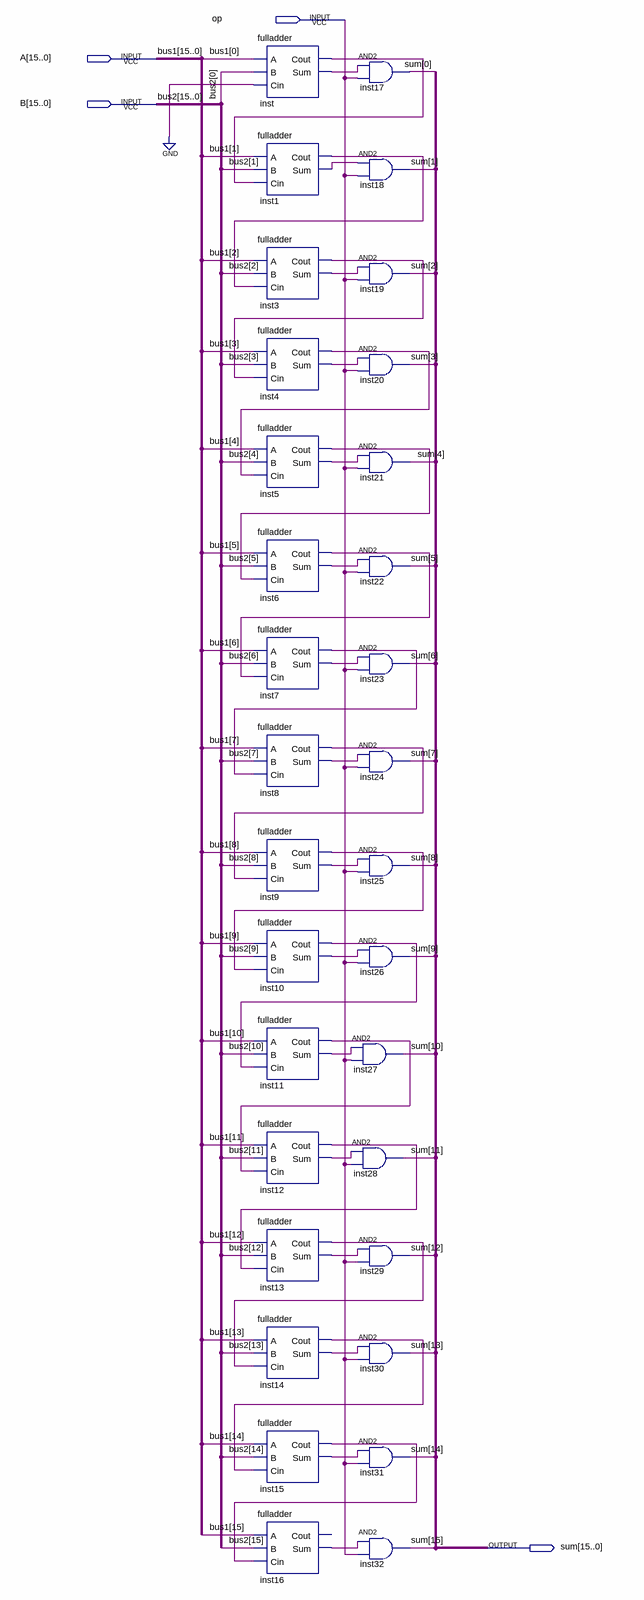
[diagram p0: schematic sheet]
// Quartus schematic adder16bit.bdf as structural Verilog: 32 symbols, 4 pins
module adder16bit (
  input  op,
  input  [15:0] A,
  input  [15:0] B,
  output [15:0] sum
);

  wire inst1_cout, inst1_sum, inst3_cout, inst3_sum, inst4_cout, inst4_sum, inst5_cout, inst5_sum,
       inst6_cout, inst6_sum, inst7_cout, inst7_sum, inst8_cout, inst8_sum, inst9_cout, inst9_sum,
       inst10_cout, inst10_sum, inst11_cout, inst11_sum, inst12_cout, inst12_sum, inst13_cout, inst13_sum,
       inst14_cout, inst14_sum, inst15_cout, inst15_sum, inst16_sum, inst_cout, inst_sum;

  fulladder inst (.A(A[0]), .B(B[0]), .Cin(1'b0), .Cout(inst_cout), .Sum(inst_sum));
  fulladder inst1 (.A(A[1]), .B(B[1]), .Cin(inst_cout), .Cout(inst1_cout), .Sum(inst1_sum));
  fulladder inst3 (.A(A[2]), .B(B[2]), .Cin(inst1_cout), .Cout(inst3_cout), .Sum(inst3_sum));
  fulladder inst4 (.A(A[3]), .B(B[3]), .Cin(inst3_cout), .Cout(inst4_cout), .Sum(inst4_sum));
  fulladder inst5 (.A(A[4]), .B(B[4]), .Cin(inst4_cout), .Cout(inst5_cout), .Sum(inst5_sum));
  fulladder inst6 (.A(A[5]), .B(B[5]), .Cin(inst5_cout), .Cout(inst6_cout), .Sum(inst6_sum));
  fulladder inst7 (.A(A[6]), .B(B[6]), .Cin(inst6_cout), .Cout(inst7_cout), .Sum(inst7_sum));
  fulladder inst8 (.A(A[7]), .B(B[7]), .Cin(inst7_cout), .Cout(inst8_cout), .Sum(inst8_sum));
  fulladder inst9 (.A(A[8]), .B(B[8]), .Cin(inst8_cout), .Cout(inst9_cout), .Sum(inst9_sum));
  fulladder inst10 (.A(A[9]), .B(B[9]), .Cin(inst9_cout), .Cout(inst10_cout), .Sum(inst10_sum));
  fulladder inst11 (.A(A[10]), .B(B[10]), .Cin(inst10_cout), .Cout(inst11_cout), .Sum(inst11_sum));
  fulladder inst12 (.A(A[11]), .B(B[11]), .Cin(inst11_cout), .Cout(inst12_cout), .Sum(inst12_sum));
  fulladder inst13 (.A(A[12]), .B(B[12]), .Cin(inst12_cout), .Cout(inst13_cout), .Sum(inst13_sum));
  fulladder inst14 (.A(A[13]), .B(B[13]), .Cin(inst13_cout), .Cout(inst14_cout), .Sum(inst14_sum));
  fulladder inst15 (.A(A[14]), .B(B[14]), .Cin(inst14_cout), .Cout(inst15_cout), .Sum(inst15_sum));
  fulladder inst16 (.A(A[15]), .B(B[15]), .Cin(inst15_cout), .Sum(inst16_sum));  // open: Cout
  and inst17 (sum[0], inst_sum, op);
  and inst18 (sum[1], inst1_sum, op);
  and inst19 (sum[2], inst3_sum, op);
  and inst20 (sum[3], inst4_sum, op);
  and inst21 (sum[4], inst5_sum, op);
  and inst22 (sum[5], inst6_sum, op);
  and inst23 (sum[6], inst7_sum, op);
  and inst24 (sum[7], inst8_sum, op);
  and inst25 (sum[8], inst9_sum, op);
  and inst26 (sum[9], inst10_sum, op);
  and inst27 (sum[10], inst11_sum, op);
  and inst28 (sum[11], inst12_sum, op);
  and inst29 (sum[12], inst13_sum, op);
  and inst30 (sum[13], inst14_sum, op);
  and inst31 (sum[14], inst15_sum, op);
  and inst32 (sum[15], inst16_sum, op);

  // Other names for the same wires on the sheet: bus1[15:0] = A; bus2[15:0] = B
endmodule
